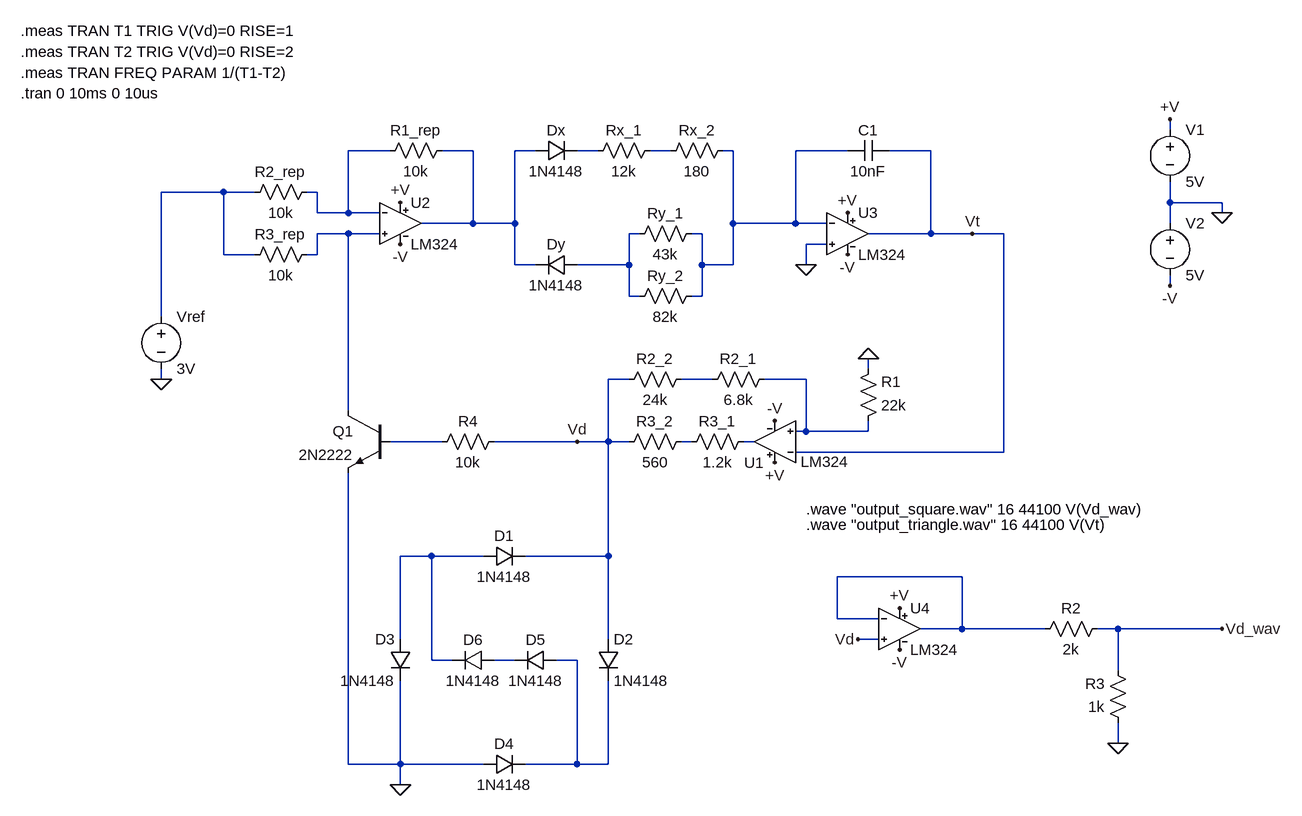
[diagram p0: schematic Proiect-E24.asc]
Proiect-E24.asc, the LTspice schematic file:
Version 4.1
SHEET 1 980 1044
WIRE 432 -480 432 -496
WIRE -768 -448 -832 -448
WIRE -640 -448 -688 -448
WIRE -544 -448 -576 -448
WIRE -448 -448 -480 -448
WIRE -336 -448 -368 -448
WIRE -240 -448 -256 -448
WIRE -64 -448 -144 -448
WIRE 64 -448 0 -448
WIRE -1024 -384 -1120 -384
WIRE -976 -384 -1024 -384
WIRE -880 -384 -896 -384
WIRE 432 -368 432 -400
WIRE 512 -368 432 -368
WIRE -880 -352 -880 -384
WIRE -832 -352 -832 -448
WIRE -832 -352 -880 -352
WIRE -784 -352 -832 -352
WIRE 512 -352 512 -368
WIRE -640 -336 -640 -448
WIRE -640 -336 -720 -336
WIRE -576 -336 -576 -448
WIRE -576 -336 -640 -336
WIRE -240 -336 -240 -448
WIRE -144 -336 -144 -448
WIRE -144 -336 -240 -336
WIRE -96 -336 -144 -336
WIRE 432 -336 432 -368
WIRE -832 -320 -880 -320
WIRE -784 -320 -832 -320
WIRE -384 -320 -400 -320
WIRE -288 -320 -304 -320
WIRE 64 -320 64 -448
WIRE 64 -320 -32 -320
WIRE 128 -320 64 -320
WIRE 176 -320 128 -320
WIRE -96 -304 -128 -304
WIRE -1024 -288 -1024 -384
WIRE -976 -288 -1024 -288
WIRE -880 -288 -880 -320
WIRE -880 -288 -896 -288
WIRE -576 -272 -576 -336
WIRE -544 -272 -576 -272
WIRE -400 -272 -400 -320
WIRE -400 -272 -480 -272
WIRE -288 -272 -288 -320
WIRE -240 -272 -240 -336
WIRE -240 -272 -288 -272
WIRE -128 -272 -128 -304
WIRE 432 -240 432 -256
WIRE -400 -224 -400 -272
WIRE -384 -224 -400 -224
WIRE -288 -224 -288 -272
WIRE -288 -224 -304 -224
WIRE -1120 -192 -1120 -384
WIRE -32 -112 -32 -128
WIRE -1120 -96 -1120 -112
WIRE -400 -96 -432 -96
WIRE -272 -96 -320 -96
WIRE -128 -96 -192 -96
WIRE -832 -48 -832 -320
WIRE -128 -16 -128 -96
WIRE -128 -16 -144 -16
WIRE -32 -16 -32 -32
WIRE -32 -16 -128 -16
WIRE -688 0 -768 0
WIRE -480 0 -608 0
WIRE -432 0 -432 -96
WIRE -432 0 -480 0
WIRE -400 0 -432 0
WIRE -304 0 -320 0
WIRE -208 0 -224 0
WIRE 176 16 176 -320
WIRE 176 16 -144 16
WIRE -704 176 -752 176
WIRE -624 176 -704 176
WIRE -432 176 -432 0
WIRE -432 176 -560 176
WIRE 112 208 -80 208
WIRE -80 272 -80 208
WIRE -16 272 -80 272
WIRE 112 288 112 208
WIRE 112 288 48 288
WIRE 240 288 112 288
WIRE 352 288 320 288
WIRE 512 288 352 288
WIRE -752 304 -752 176
WIRE -432 304 -432 176
WIRE -16 304 -48 304
WIRE -704 336 -704 176
WIRE -672 336 -704 336
WIRE -576 336 -608 336
WIRE -480 336 -512 336
WIRE 352 352 352 288
WIRE 352 464 352 432
WIRE -832 496 -832 48
WIRE -752 496 -752 368
WIRE -752 496 -832 496
WIRE -624 496 -752 496
WIRE -480 496 -480 336
WIRE -480 496 -560 496
WIRE -432 496 -432 368
WIRE -432 496 -480 496
WIRE -752 528 -752 496
FLAG 512 -352 0
FLAG 432 -496 +V
FLAG 432 -240 -V
FLAG -176 32 +V
FLAG -176 -32 -V
FLAG -752 528 0
FLAG -1120 -96 0
FLAG -752 -304 -V
FLAG -752 -368 +V
FLAG -64 -352 +V
FLAG -64 -288 -V
FLAG -128 -272 0
FLAG -32 -128 0
FLAG -480 0 Vd
FLAG 128 -320 Vt
FLAG 352 464 0
FLAG 512 288 Vd_wav
FLAG -48 304 Vd
FLAG 16 320 -V
FLAG 16 256 +V
SYMBOL voltage 432 -496 R0
SYMATTR InstName V1
SYMATTR Value 5V
SYMBOL voltage 432 -352 R0
SYMATTR InstName V2
SYMATTR Value 5V
SYMBOL LM324 -176 64 R180
WINDOW 3 -114 33 Left 2
SYMATTR InstName U1
SYMBOL res -48 -16 M180
WINDOW 0 36 76 Left 2
WINDOW 3 36 40 Left 2
SYMATTR InstName R1
SYMATTR Value 22k
SYMBOL diode -448 304 R0
SYMATTR InstName D2
SYMATTR Value 1N4148
SYMBOL diode -624 192 R270
WINDOW 0 32 32 VTop 2
WINDOW 3 0 32 VBottom 2
SYMATTR InstName D1
SYMATTR Value 1N4148
SYMBOL diode -736 304 M0
SYMATTR InstName D3
SYMATTR Value 1N4148
SYMBOL diode -624 512 R270
WINDOW 0 32 32 VTop 2
WINDOW 3 0 32 VBottom 2
SYMATTR InstName D4
SYMATTR Value 1N4148
SYMBOL diode -512 320 R90
WINDOW 0 0 32 VBottom 2
WINDOW 3 32 32 VTop 2
SYMATTR InstName D5
SYMATTR Value 1N4148
SYMBOL diode -608 320 R90
WINDOW 0 0 32 VBottom 2
WINDOW 3 32 32 VTop 2
SYMATTR InstName D6
SYMATTR Value 1N4148
SYMBOL res -592 -16 R90
WINDOW 0 0 56 VBottom 2
WINDOW 3 32 56 VTop 2
SYMATTR InstName R4
SYMATTR Value 10k
SYMBOL npn -768 -48 M0
SYMATTR InstName Q1
SYMATTR Value 2N2222
SYMBOL LM324 -752 -400 R0
SYMATTR InstName U2
SYMBOL res -672 -464 R90
WINDOW 0 0 56 VBottom 2
WINDOW 3 32 56 VTop 2
SYMATTR InstName R1_rep
SYMATTR Value 10k
SYMBOL res -880 -304 R90
WINDOW 0 0 56 VBottom 2
WINDOW 3 32 56 VTop 2
SYMATTR InstName R3_rep
SYMATTR Value 10k
SYMBOL res -880 -400 R90
WINDOW 0 0 56 VBottom 2
WINDOW 3 32 56 VTop 2
SYMATTR InstName R2_rep
SYMATTR Value 10k
SYMBOL LM324 -64 -384 R0
SYMATTR InstName U3
SYMBOL diode -544 -432 R270
WINDOW 0 32 32 VTop 2
WINDOW 3 0 32 VBottom 2
SYMATTR InstName Dx
SYMATTR Value 1N4148
SYMBOL diode -480 -256 M270
WINDOW 0 32 32 VTop 2
WINDOW 3 0 32 VBottom 2
SYMATTR InstName Dy
SYMATTR Value 1N4148
SYMBOL res -352 -464 R90
WINDOW 0 0 56 VBottom 2
WINDOW 3 32 56 VTop 2
SYMATTR InstName Rx_1
SYMATTR Value 12k
SYMBOL cap 0 -464 R90
WINDOW 0 0 32 VBottom 2
WINDOW 3 32 32 VTop 2
SYMATTR InstName C1
SYMATTR Value 10nF
SYMBOL res -240 -464 R90
WINDOW 0 0 56 VBottom 2
WINDOW 3 32 56 VTop 2
SYMATTR InstName Rx_2
SYMATTR Value 180
SYMBOL res -288 -336 R90
WINDOW 0 0 56 VBottom 2
WINDOW 3 32 56 VTop 2
SYMATTR InstName Ry_1
SYMATTR Value 43k
SYMBOL res -288 -240 R90
WINDOW 0 0 56 VBottom 2
WINDOW 3 32 56 VTop 2
SYMATTR InstName Ry_2
SYMATTR Value 82k
SYMBOL res -208 -16 R90
WINDOW 0 0 56 VBottom 2
WINDOW 3 32 56 VTop 2
SYMATTR InstName R3_1
SYMATTR Value 1.2k
SYMBOL res -304 -16 R90
WINDOW 0 0 56 VBottom 2
WINDOW 3 32 56 VTop 2
SYMATTR InstName R3_2
SYMATTR Value 560
SYMBOL res -304 -112 R90
WINDOW 0 0 56 VBottom 2
WINDOW 3 32 56 VTop 2
SYMATTR InstName R2_2
SYMATTR Value 24k
SYMBOL res -176 -112 R90
WINDOW 0 0 56 VBottom 2
WINDOW 3 32 56 VTop 2
SYMATTR InstName R2_1
SYMATTR Value 6.8k
SYMBOL res 336 272 R90
WINDOW 0 0 56 VBottom 2
WINDOW 3 32 56 VTop 2
SYMATTR InstName R2
SYMATTR Value 2k
SYMBOL res 368 448 R180
WINDOW 0 36 76 Left 2
WINDOW 3 36 40 Left 2
SYMATTR InstName R3
SYMATTR Value 1k
SYMBOL LM324 16 224 R0
SYMATTR InstName U4
SYMBOL voltage -1120 -208 R0
SYMATTR InstName Vref
SYMATTR Value 3V
TEXT -1336 -536 Left 2 !.tran 0 10ms 0 10us
TEXT -1336 -632 Left 2 !.meas TRAN T1 TRIG V(Vd)=0 RISE=1
TEXT -1336 -600 Left 2 !.meas TRAN T2 TRIG V(Vd)=0 RISE=2
TEXT -1336 -568 Left 2 !.meas TRAN FREQ PARAM 1/(T1-T2)
TEXT -128 104 Left 2 !.wave "output_square.wav" 16 44100 V(Vd_wav)
TEXT -128 128 Left 2 !.wave "output_triangle.wav" 16 44100 V(Vt)

The netlist it stands for:
* Proiect-E24.asc
V1 +V 0 5V
V2 0 -V 5V
X§U1 N010 Vt +V -V N013 LM324  ; pins In+ In- V+ V- OUT
R1 N010 0 22k
D2 Vd N017 1N4148
D1 N014 Vd 1N4148
D3 N014 0 1N4148
D4 0 N017 1N4148
D5 N017 N016 1N4148
D6 N016 N014 1N4148
R4 Vd N011 10k
Q1 N007 N011 0 0 2N2222
X§U2 N007 N001 +V -V N002 LM324  ; pins In+ In- V+ V- OUT
R1_rep N002 N001 10k
R3_rep N007 N006 10k
R2_rep N001 N006 10k
X§U3 0 N005 +V -V Vt LM324  ; pins In+ In- V+ V- OUT
Dx N002 N003 1N4148
Dy N008 N002 1N4148
Rx_1 N004 N003 12k
C1 Vt N005 10nF
Rx_2 N005 N004 180
Ry_1 N005 N008 43k
Ry_2 N005 N008 82k
R3_1 N013 N012 1.2k
R3_2 N012 Vd 560
R2_2 N009 Vd 24k
R2_1 N010 N009 6.8k
R2 Vd_wav N015 2k
R3 0 Vd_wav 1k
X§U4 Vd N015 +V -V N015 LM324  ; pins In+ In- V+ V- OUT
Vref N006 0 3V
.model D D
.lib standard.dio
.model NPN NPN
.model PNP PNP
.lib standard.bjt
.tran 0 10ms 0 10us
.meas TRAN T1 TRIG V(Vd)=0 RISE=1
.meas TRAN T2 TRIG V(Vd)=0 RISE=2
.meas TRAN FREQ PARAM 1/(T1-T2)
.wave "output_square.wav" 16 44100 V(Vd_wav)
.wave "output_triangle.wav" 16 44100 V(Vt)
.lib LM324.lib
.backanno
.end